# Altium project OpenRIS_0v1.PrjPcb
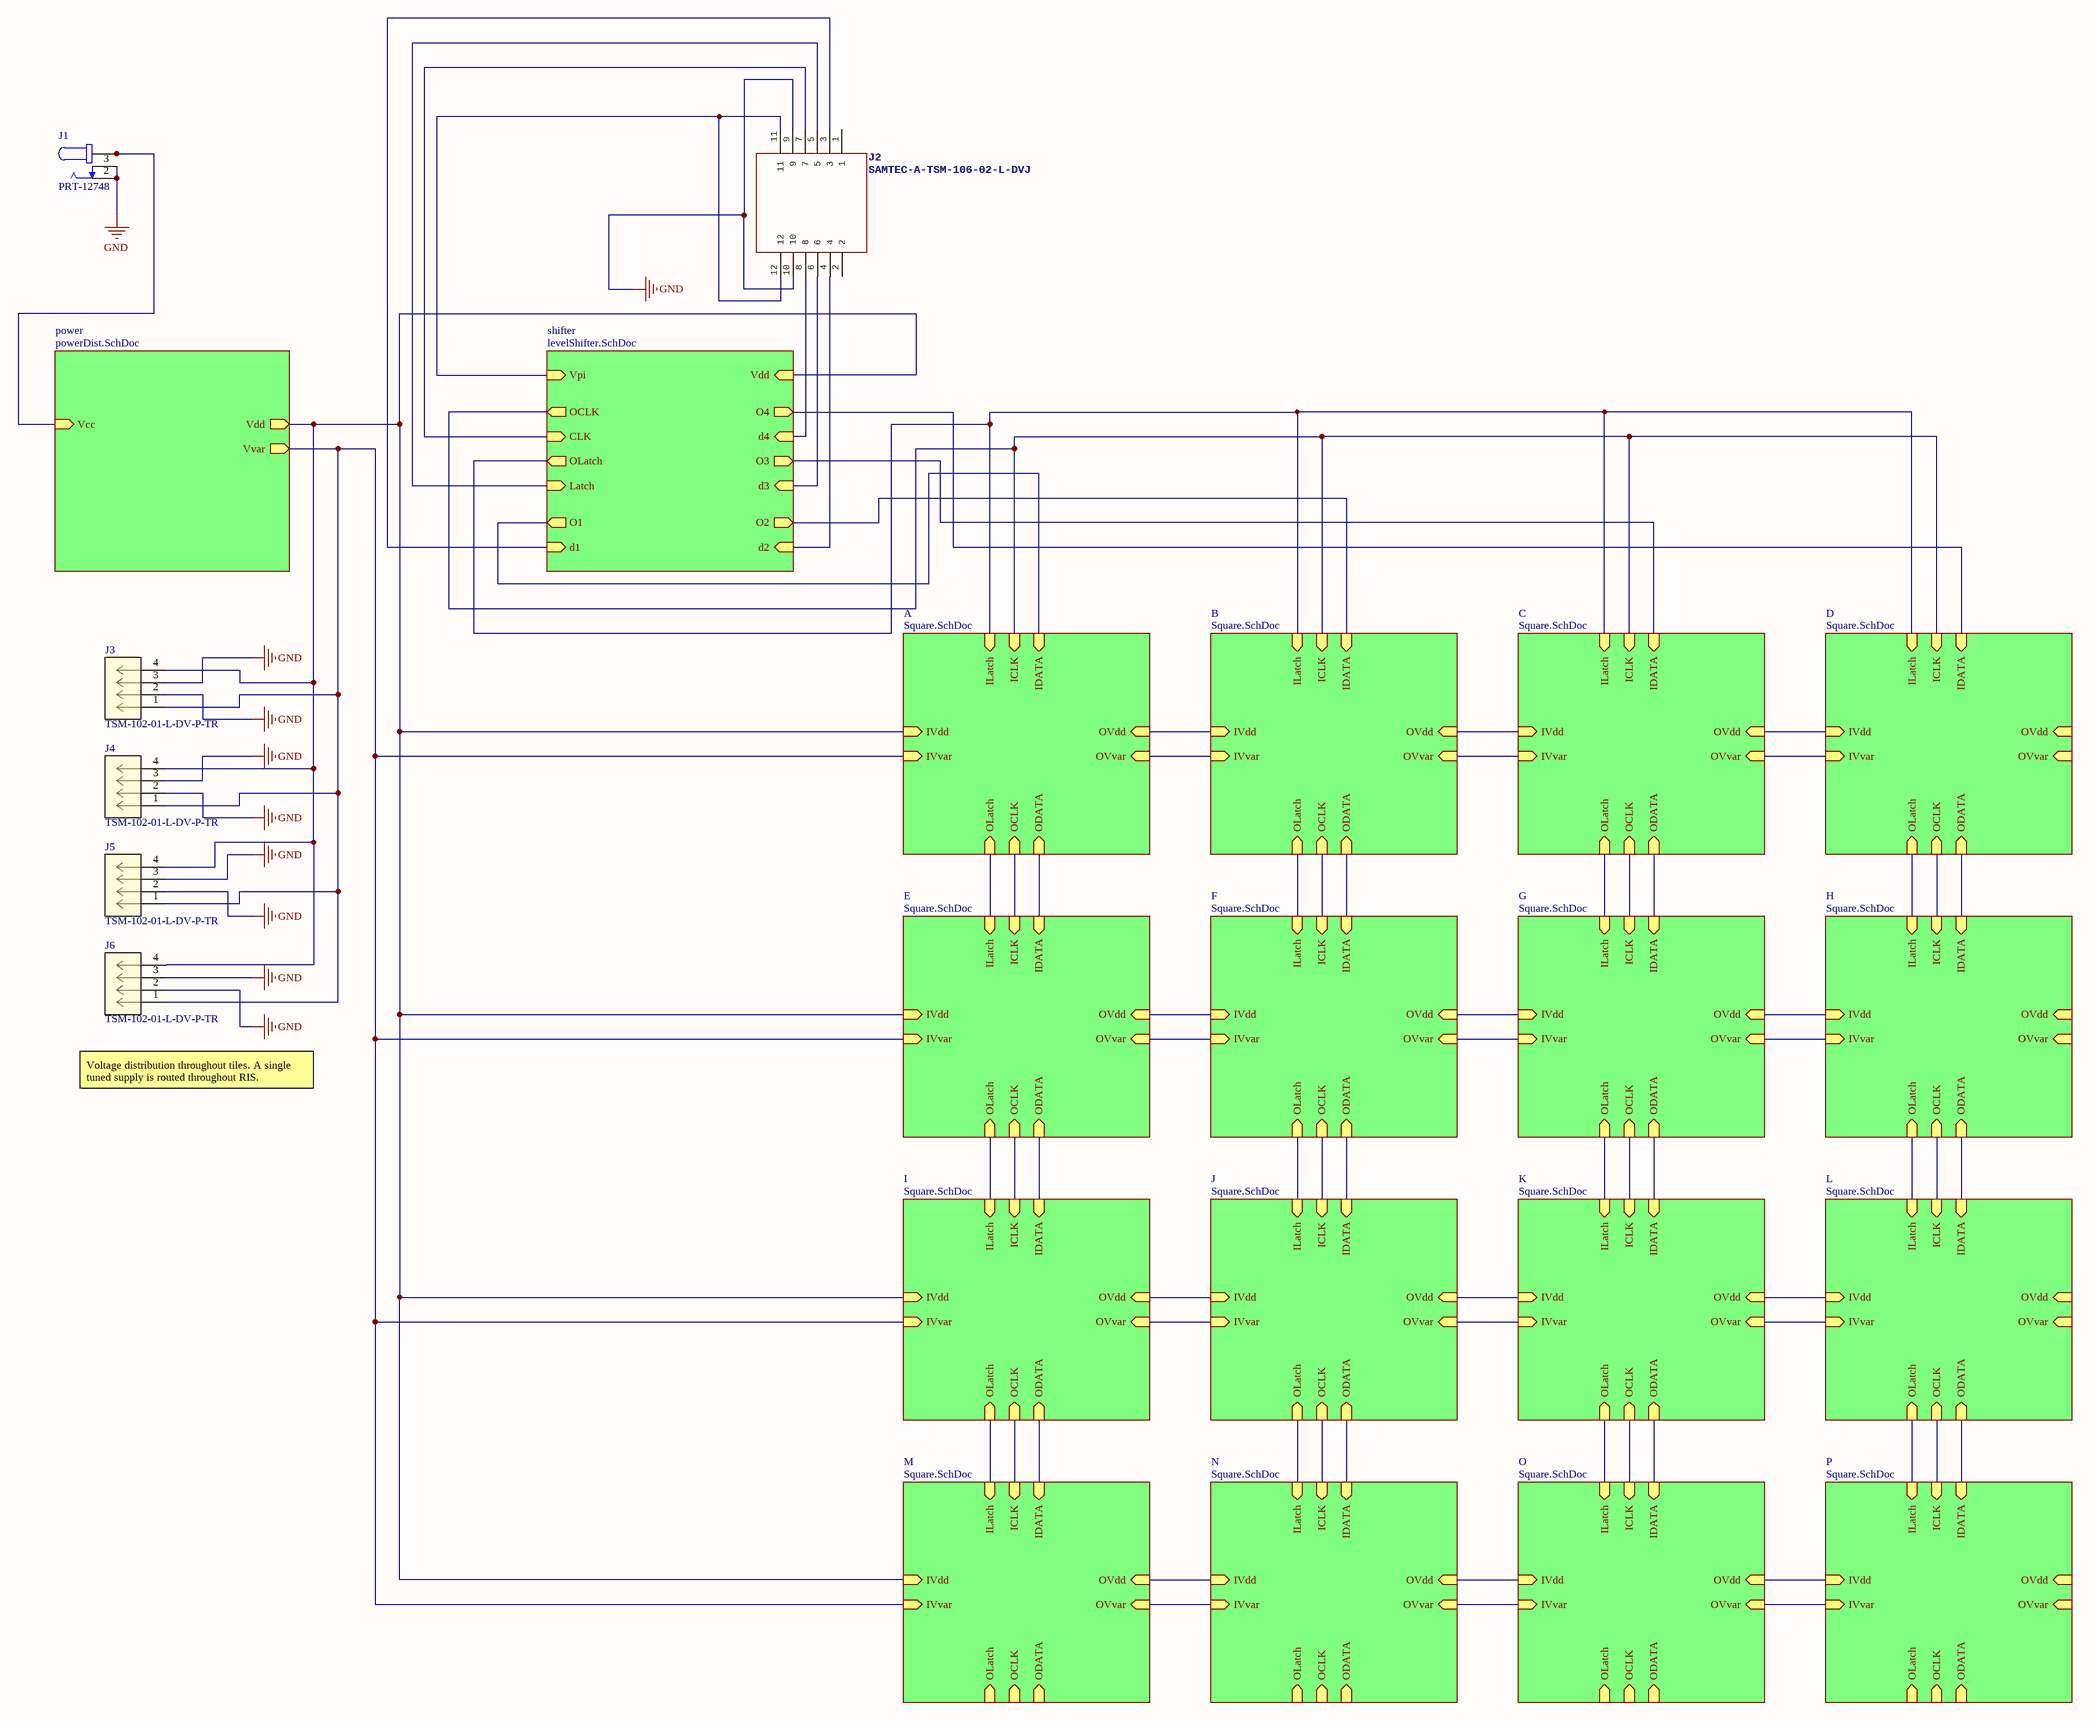
[diagram p0: main.SchDoc]
4 sheets, 547 parts. Net scope: hierarchical (ports join the sheet entries above them; power ports are global).
Board files: OpenRIS_PCB_0v1.PcbDoc, unitcells.PcbDoc, unitCell.PcbDoc
Sheets:
  main.SchDoc
    shifter = levelShifter.SchDoc
    power = powerDist.SchDoc
    A = Square.SchDoc
    E = Square.SchDoc
    I = Square.SchDoc
    M = Square.SchDoc
    B = Square.SchDoc
    F = Square.SchDoc
    J = Square.SchDoc
    N = Square.SchDoc
    C = Square.SchDoc
    G = Square.SchDoc
    K = Square.SchDoc
    O = Square.SchDoc
    D = Square.SchDoc
    H = Square.SchDoc
    L = Square.SchDoc
    P = Square.SchDoc

## Sheet main.SchDoc
size A2; SheetNumber: 1; SheetTotal: 4

### Parts
J1  PRT-12748  [SPARKFUN_PRT-12748]
J2  SAMTEC-A-TSM-106-02-L-DVJ  [SAMTEC-A-TSM-106-02-L-DV]
J3  TSM-102-01-L-DV-P-TR  [SAMTEC-A-TSM-102-02-L-DV]
J4  TSM-102-01-L-DV-P-TR  [SAMTEC-A-TSM-102-02-L-DV]
J5  TSM-102-01-L-DV-P-TR  [SAMTEC-A-TSM-102-02-L-DV]
J6  TSM-102-01-L-DV-P-TR  [SAMTEC-A-TSM-102-02-L-DV]

### Sub-sheets
A = Square.SchDoc: IVvar (in), IVdd (in), IDATA (in), ICLK (in), ILatch (in), OLatch (in), OCLK (in), ODATA (in), OVvar (in), OVdd (in)
B = Square.SchDoc: IVvar (in), IVdd (in), IDATA (in), ICLK (in), ILatch (in), OLatch (in), OCLK (in), ODATA (in), OVvar (in), OVdd (in)
C = Square.SchDoc: IVvar (in), IVdd (in), IDATA (in), ICLK (in), ILatch (in), OLatch (in), OCLK (in), ODATA (in), OVvar (in), OVdd (in)
D = Square.SchDoc: IVvar (in), IVdd (in), IDATA (in), ICLK (in), ILatch (in), OLatch (in), OCLK (in), ODATA (in), OVvar (in), OVdd (in)
E = Square.SchDoc: IVvar (in), IVdd (in), IDATA (in), ICLK (in), ILatch (in), OLatch (in), OCLK (in), ODATA (in), OVvar (in), OVdd (in)
F = Square.SchDoc: IVvar (in), IVdd (in), IDATA (in), ICLK (in), ILatch (in), OLatch (in), OCLK (in), ODATA (in), OVvar (in), OVdd (in)
G = Square.SchDoc: IVvar (in), IVdd (in), IDATA (in), ICLK (in), ILatch (in), OLatch (in), OCLK (in), ODATA (in), OVvar (in), OVdd (in)
H = Square.SchDoc: IVvar (in), IVdd (in), IDATA (in), ICLK (in), ILatch (in), OLatch (in), OCLK (in), ODATA (in), OVvar (in), OVdd (in)
I = Square.SchDoc: IVvar (in), IVdd (in), IDATA (in), ICLK (in), ILatch (in), OLatch (in), OCLK (in), ODATA (in), OVvar (in), OVdd (in)
J = Square.SchDoc: IVvar (in), IVdd (in), IDATA (in), ICLK (in), ILatch (in), OLatch (in), OCLK (in), ODATA (in), OVvar (in), OVdd (in)
K = Square.SchDoc: IVvar (in), IVdd (in), IDATA (in), ICLK (in), ILatch (in), OLatch (in), OCLK (in), ODATA (in), OVvar (in), OVdd (in)
L = Square.SchDoc: IVvar (in), IVdd (in), IDATA (in), ICLK (in), ILatch (in), OLatch (in), OCLK (in), ODATA (in), OVvar (in), OVdd (in)
M = Square.SchDoc: IVvar (in), IVdd (in), IDATA (in), ICLK (in), ILatch (in), OLatch (in), OCLK (in), ODATA (in), OVvar (in), OVdd (in)
N = Square.SchDoc: IVvar (in), IVdd (in), IDATA (in), ICLK (in), ILatch (in), OLatch (in), OCLK (in), ODATA (in), OVvar (in), OVdd (in)
O = Square.SchDoc: IVvar (in), IVdd (in), IDATA (in), ICLK (in), ILatch (in), OLatch (in), OCLK (in), ODATA (in), OVvar (in), OVdd (in)
P = Square.SchDoc: IVvar (in), IVdd (in), IDATA (in), ICLK (in), ILatch (in), OLatch (in), OCLK (in), ODATA (in), OVvar (in), OVdd (in)
power = powerDist.SchDoc: Vvar (out), Vdd (out), Vcc (in)
shifter = levelShifter.SchDoc: Vpi (in), Vdd (in), Latch (in), CLK (in), d2 (in), d3 (in), d4 (in), d1 (in), OCLK (out), OLatch (out), O1 (out), O2 (out), O3 (out), O4 (out)

### Nets
GND: J1.2 J1.3 J2.9 J2.10 J3.2 J3.3 J4.2 J4.3 J5.2 J5.3 J6.2 J6.3
NetC1_1: J3.1 J4.1 J5.1 J6.1 ; sheet power/Vvar, sheet A/IVvar, sheet A/OVvar, sheet E/IVvar, sheet E/OVvar, sheet I/IVvar, sheet I/OVvar, sheet M/IVvar, sheet M/OVvar, sheet B/IVvar, sheet B/OVvar, sheet F/IVvar, sheet F/OVvar, sheet J/IVvar, sheet J/OVvar, sheet N/IVvar, sheet N/OVvar, sheet C/IVvar, sheet C/OVvar, sheet G/IVvar, sheet G/OVvar, sheet K/IVvar, sheet K/OVvar, sheet O/IVvar, sheet O/OVvar, sheet D/IVvar, sheet D/OVvar, sheet H/IVvar, sheet H/OVvar, sheet L/IVvar, sheet L/OVvar, sheet P/IVvar, sheet P/OVvar
NetC2_1: J3.4 J4.4 J5.4 J6.4 ; sheet shifter/Vdd, sheet power/Vdd, sheet A/IVdd, sheet A/OVdd, sheet E/IVdd, sheet E/OVdd, sheet I/IVdd, sheet I/OVdd, sheet M/IVdd, sheet M/OVdd, sheet B/IVdd, sheet B/OVdd, sheet F/IVdd, sheet F/OVdd, sheet J/IVdd, sheet J/OVdd, sheet N/IVdd, sheet N/OVdd, sheet C/IVdd, sheet C/OVdd, sheet G/IVdd, sheet G/OVdd, sheet K/IVdd, sheet K/OVdd, sheet O/IVdd, sheet O/OVdd, sheet D/IVdd, sheet D/OVdd, sheet H/IVdd, sheet H/OVdd, sheet L/IVdd, sheet L/OVdd, sheet P/IVdd, sheet P/OVdd
NetIC1_3: J1.1_1 J1.1_2 ; sheet power/Vcc
NetJ2_3: J2.3 ; sheet shifter/d1
NetJ2_4: J2.4 ; sheet shifter/d2
NetJ2_5: J2.5 ; sheet shifter/Latch
NetJ2_6: J2.6 ; sheet shifter/d3
NetJ2_7: J2.7 ; sheet shifter/CLK
NetJ2_8: J2.8 ; sheet shifter/d4
NetJ2_11: J2.11 J2.12 ; sheet shifter/Vpi
NetU1_2: sheet shifter/OCLK, sheet A/ICLK, sheet A/OCLK, sheet E/ICLK, sheet E/OCLK, sheet I/ICLK, sheet I/OCLK, sheet M/ICLK, sheet M/OCLK, sheet B/ICLK, sheet B/OCLK, sheet F/ICLK, sheet F/OCLK, sheet J/ICLK, sheet J/OCLK, sheet N/ICLK, sheet N/OCLK, sheet C/ICLK, sheet C/OCLK, sheet G/ICLK, sheet G/OCLK, sheet K/ICLK, sheet K/OCLK, sheet O/ICLK, sheet O/OCLK, sheet D/ICLK, sheet D/OCLK, sheet H/ICLK, sheet H/OCLK, sheet L/ICLK, sheet L/OCLK, sheet P/ICLK, sheet P/OCLK
NetU1_4: sheet shifter/OLatch, sheet A/ILatch, sheet A/OLatch, sheet E/ILatch, sheet E/OLatch, sheet I/ILatch, sheet I/OLatch, sheet M/ILatch, sheet M/OLatch, sheet B/ILatch, sheet B/OLatch, sheet F/ILatch, sheet F/OLatch, sheet J/ILatch, sheet J/OLatch, sheet N/ILatch, sheet N/OLatch, sheet C/ILatch, sheet C/OLatch, sheet G/ILatch, sheet G/OLatch, sheet K/ILatch, sheet K/OLatch, sheet O/ILatch, sheet O/OLatch, sheet D/ILatch, sheet D/OLatch, sheet H/ILatch, sheet H/OLatch, sheet L/ILatch, sheet L/OLatch, sheet P/ILatch, sheet P/OLatch
NetU1_6: sheet shifter/O1, sheet A/IDATA
NetU1_10: sheet shifter/O2, sheet B/IDATA
NetU1_12: sheet shifter/O3, sheet C/IDATA
NetU1_15: sheet shifter/O4, sheet D/IDATA
NetU2_A_23: sheet A/ODATA, sheet E/IDATA
NetU2_B_23: sheet B/ODATA, sheet F/IDATA
NetU2_C_23: sheet C/ODATA, sheet G/IDATA
NetU2_D_23: sheet D/ODATA, sheet H/IDATA
NetU2_E_23: sheet E/ODATA, sheet I/IDATA
NetU2_F_23: sheet F/ODATA, sheet J/IDATA
NetU2_G_23: sheet G/ODATA, sheet K/IDATA
NetU2_H_23: sheet H/ODATA, sheet L/IDATA
NetU2_I_23: sheet I/ODATA, sheet M/IDATA
NetU2_J_23: sheet J/ODATA, sheet N/IDATA
NetU2_K_23: sheet K/ODATA, sheet O/IDATA
NetU2_L_23: sheet L/ODATA, sheet P/IDATA

Not connected (* = marked no-connect by the designer): J2 1 2

### Notes on the sheet
- Voltage distribution throughout tiles. A single tuned supply is routed throughout RIS.

### Library data of the parts
J1 = PRT-12748: SparkFun Accessories DC Barrel Power Jack Connector SMD; Package: None; SnapEDA_Link: https://www.snapeda.com/parts/PRT-12748/SparkFun/view-part/?ref=snap; Value: *; MP: PRT-12748; Availability: In Stock; MF: SparkFun; Price: None; Purchase-URL: https://pricing.snapeda.com/search/part/PRT-12748/?ref=eda; Check_prices: https://www.snapeda.com/parts/PRT-12748/SparkFun/view-part/?ref=eda
J3-J6 = TSM-102-01-L-DV-P-TR: No Description Available; Mfr_Name: Samtec Inc; Copyright: Copyright (C) 2022 Ultra Librarian. All rights reserved.; Manufacturer_Part_Number: TSM-102-01-L-DV-P-TR; RefDes: RefDes; Type: DEV

## Sheet levelShifter.SchDoc
size A4; SheetNumber: 4; SheetTotal: 4
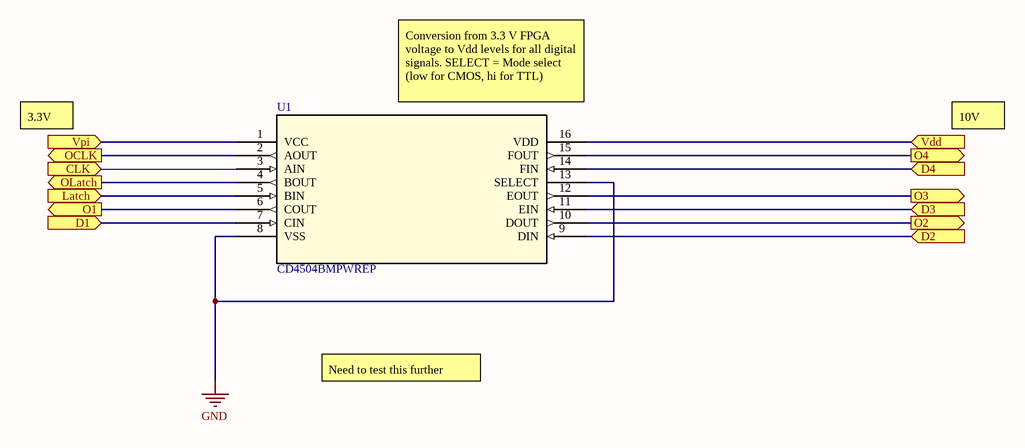
[diagram p1: levelShifter.SchDoc]

### Parts
U1  CD4504BMPWREP  [PW16]

### Ports
CLK (in), D1 (in), D2 (in), D3 (in), D4 (in), Latch (in), O1 (out), O2 (out), O3 (out), O4 (out), OCLK (out), OLatch (out), Vdd (in), Vpi (in)

### Nets
GND: U1.8(VSS) U1.13(SELECT)
NetC2_1: U1.16(VDD) ; port Vdd
NetJ2_3: U1.7(CIN) ; port D1
NetJ2_4: U1.9(DIN) ; port D2
NetJ2_5: U1.5(BIN) ; port Latch
NetJ2_6: U1.11(EIN) ; port D3
NetJ2_7: U1.3(AIN) ; port CLK
NetJ2_8: U1.14(FIN) ; port D4
NetJ2_11: U1.1(VCC) ; port Vpi
NetU1_2: U1.2(AOUT) ; port OCLK
NetU1_4: U1.4(BOUT) ; port OLatch
NetU1_6: U1.6(COUT) ; port O1
NetU1_10: U1.10(DOUT) ; port O2
NetU1_12: U1.12(EOUT) ; port O3
NetU1_15: U1.15(FOUT) ; port O4

### Notes on the sheet
- 3.3V
- (near U1) Conversion from 3.3 V FPGA voltage to Vdd levels for all digital signals. SELECT = Mode select (low for CMOS, hi for TTL)
- 10V
- Need to test this further

### Library data of the parts
U1 = CD4504BMPWREP: No Description Available; Mfr_Name: Texas Instruments; Copyright: Copyright (C) 2022 Ultra Librarian. All rights reserved.; Manufacturer_Part_Number: CD4504BMPWREP; RefDes: RefDes; Type: DEV

## Sheet powerDist.SchDoc
size E; SheetNumber: 3; SheetTotal: 4
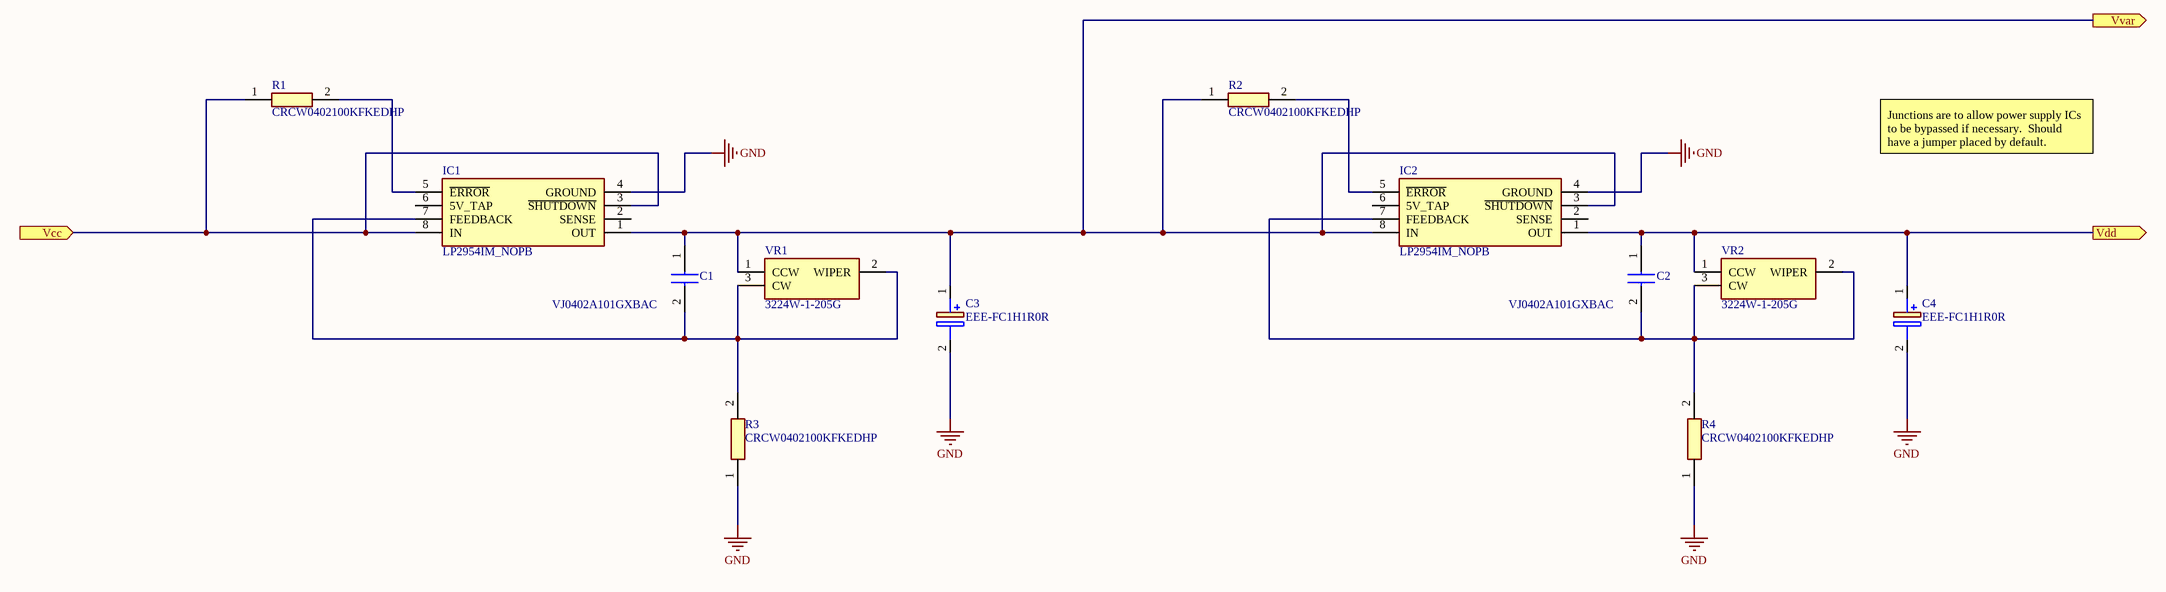
[diagram p2: powerDist.SchDoc]

### Parts
C1  VJ0402A101GXBAC  [CAPC1005X55N]
C2  VJ0402A101GXBAC  [CAPC1005X55N]
C3  EEE-FC1H1R0R  [EEE1AA220WR]
C4  EEE-FC1H1R0R  [EEE1AA220WR]
IC1  LP2954IM_NOPB  [SOIC127P600X175-8N]
IC2  LP2954IM_NOPB  [SOIC127P600X175-8N]
R1  CRCW0402100KFKEDHP  [RESC1005X40N]
R2  CRCW0402100KFKEDHP  [RESC1005X40N]
R3  CRCW0402100KFKEDHP  [RESC1005X40N]
R4  CRCW0402100KFKEDHP  [RESC1005X40N]
VR1  3224W-1-205G  [3224W1205G]
VR2  3224W-1-205G  [3224W1205G]

### Ports
Vcc (in), Vdd (out), Vvar (out)

### Nets
GND: C3.2(-) C4.2(-) IC1.4(GROUND) IC2.4(GROUND) R3.1 R4.1
NetC1_1: C1.1 C3.1(+) IC1.1(OUT) IC2.3(~{SHUTDOWN}) IC2.8(IN) R2.1 VR1.1(CCW) ; port Vvar
NetC1_2: C1.2 IC1.7(FEEDBACK) R3.2 VR1.2(WIPER) VR1.3(CW)
NetC2_1: C2.1 C4.1(+) IC2.1(OUT) VR2.1(CCW) ; port Vdd
NetC2_2: C2.2 IC2.7(FEEDBACK) R4.2 VR2.2(WIPER) VR2.3(CW)
NetIC1_3: IC1.3(~{SHUTDOWN}) IC1.8(IN) R1.1 ; port Vcc
NetIC1_5: IC1.5(~{ERROR}) R1.2
NetIC2_5: IC2.5(~{ERROR}) R2.2

Not connected (* = marked no-connect by the designer): IC1 2(SENSE) 6(5V_TAP); IC2 2(SENSE) 6(5V_TAP)

### Notes on the sheet
- Junctions are to allow power supply ICs to be bypassed if necessary.  Should have a jumper placed by default.

### Library data of the parts
C1 C2 = VJ0402A101GXBAC: Capacitor; Manufacturer_Name: Vishay; Datasheet Link: http://www.vishay.com/docs/45226/vj31xrohsautomlcc.pdf; Height: 0.55mm; Manufacturer_Part_Number: VJ0402A101GXBAC; Mouser Part Number: 77-VJ0402A101GXBAC; Mouser Price/Stock: https://www.mouser.com/Search/Refine.aspx?Keyword=77-VJ0402A101GXBAC
C3 C4 = EEE-FC1H1R0R: Capacitor Polarised; Manufacturer_Name: Panasonic; Datasheet Link: http://industrial.panasonic.com/cdbs/www-data/pdf/RDE0000/ABA0000C1172.pdf; Height: 5.5mm; Manufacturer_Part_Number: EEE-FC1H1R0R
IC1 IC2 = LP2954IM_NOPB: Integrated Circuit; Manufacturer_Name: Texas Instruments; Manufacturer_Part_Number: LP2954IM/NOPB; Datasheet Link: http://www.ti.com/lit/ds/symlink/lp2954.pdf; Height: 1.75mm; Mouser Part Number: 926-LP2954IM/NOPB; Mouser Price/Stock: https://www.mouser.co.uk/ProductDetail/Texas-Instruments/LP2954IM-NOPB?qs=7lkVKPoqpbabRBZ4oJW1Cw%3D%3D; Arrow Part Number: LP2954IM/NOPB; Arrow Price/Stock: https://www.arrow.com/en/products/lp2954imnopb/texas-instruments
R1-R4 = CRCW0402100KFKEDHP: Resistor; Manufacturer_Name: Vishay; Datasheet Link: http://www.vishay.com/docs/20035/dcrcwe3.pdf; Height: 0.4mm; Manufacturer_Part_Number: CRCW0402100KFKEDHP; Mouser Part Number: 71-CRCW0402100KFKEDH; Mouser Price/Stock: https://www.mouser.co.uk/ProductDetail/Vishay-Dale/CRCW0402100KFKEDHP?qs=k2%2FDWSARqgGFakjlJe4Ejw%3D%3D; Arrow Part Number: CRCW0402100KFKEDHP; Arrow Price/Stock: https://www.arrow.com/en/products/crcw0402100kfkedhp/vishay?region=nac
VR1 VR2 = 3224W-1-205G: Variable Resistor; Manufacturer_Name: Bourns; Datasheet Link: https://componentsearchengine.com/Datasheets/1/3224W-1-205G.pdf; Height: 5.3mm; Manufacturer_Part_Number: 3224W-1-205G; Mouser Part Number: 652-3224W-1-205G; Mouser Price/Stock: https://www.mouser.co.uk/ProductDetail/Bourns/3224W-1-205G?qs=ex25RYyDdK9tk4UnpJ5t%2Fg%3D%3D

## Sheet Square.SchDoc
size 863 x 558 mm; SheetNumber: 4; SheetTotal: 4
Used 16 times, as channels A, E, I, M, B, F, J, N, C, G, K, O, D, H, L, P. Parts and nets are listed once, with the designators drawn on the sheet.
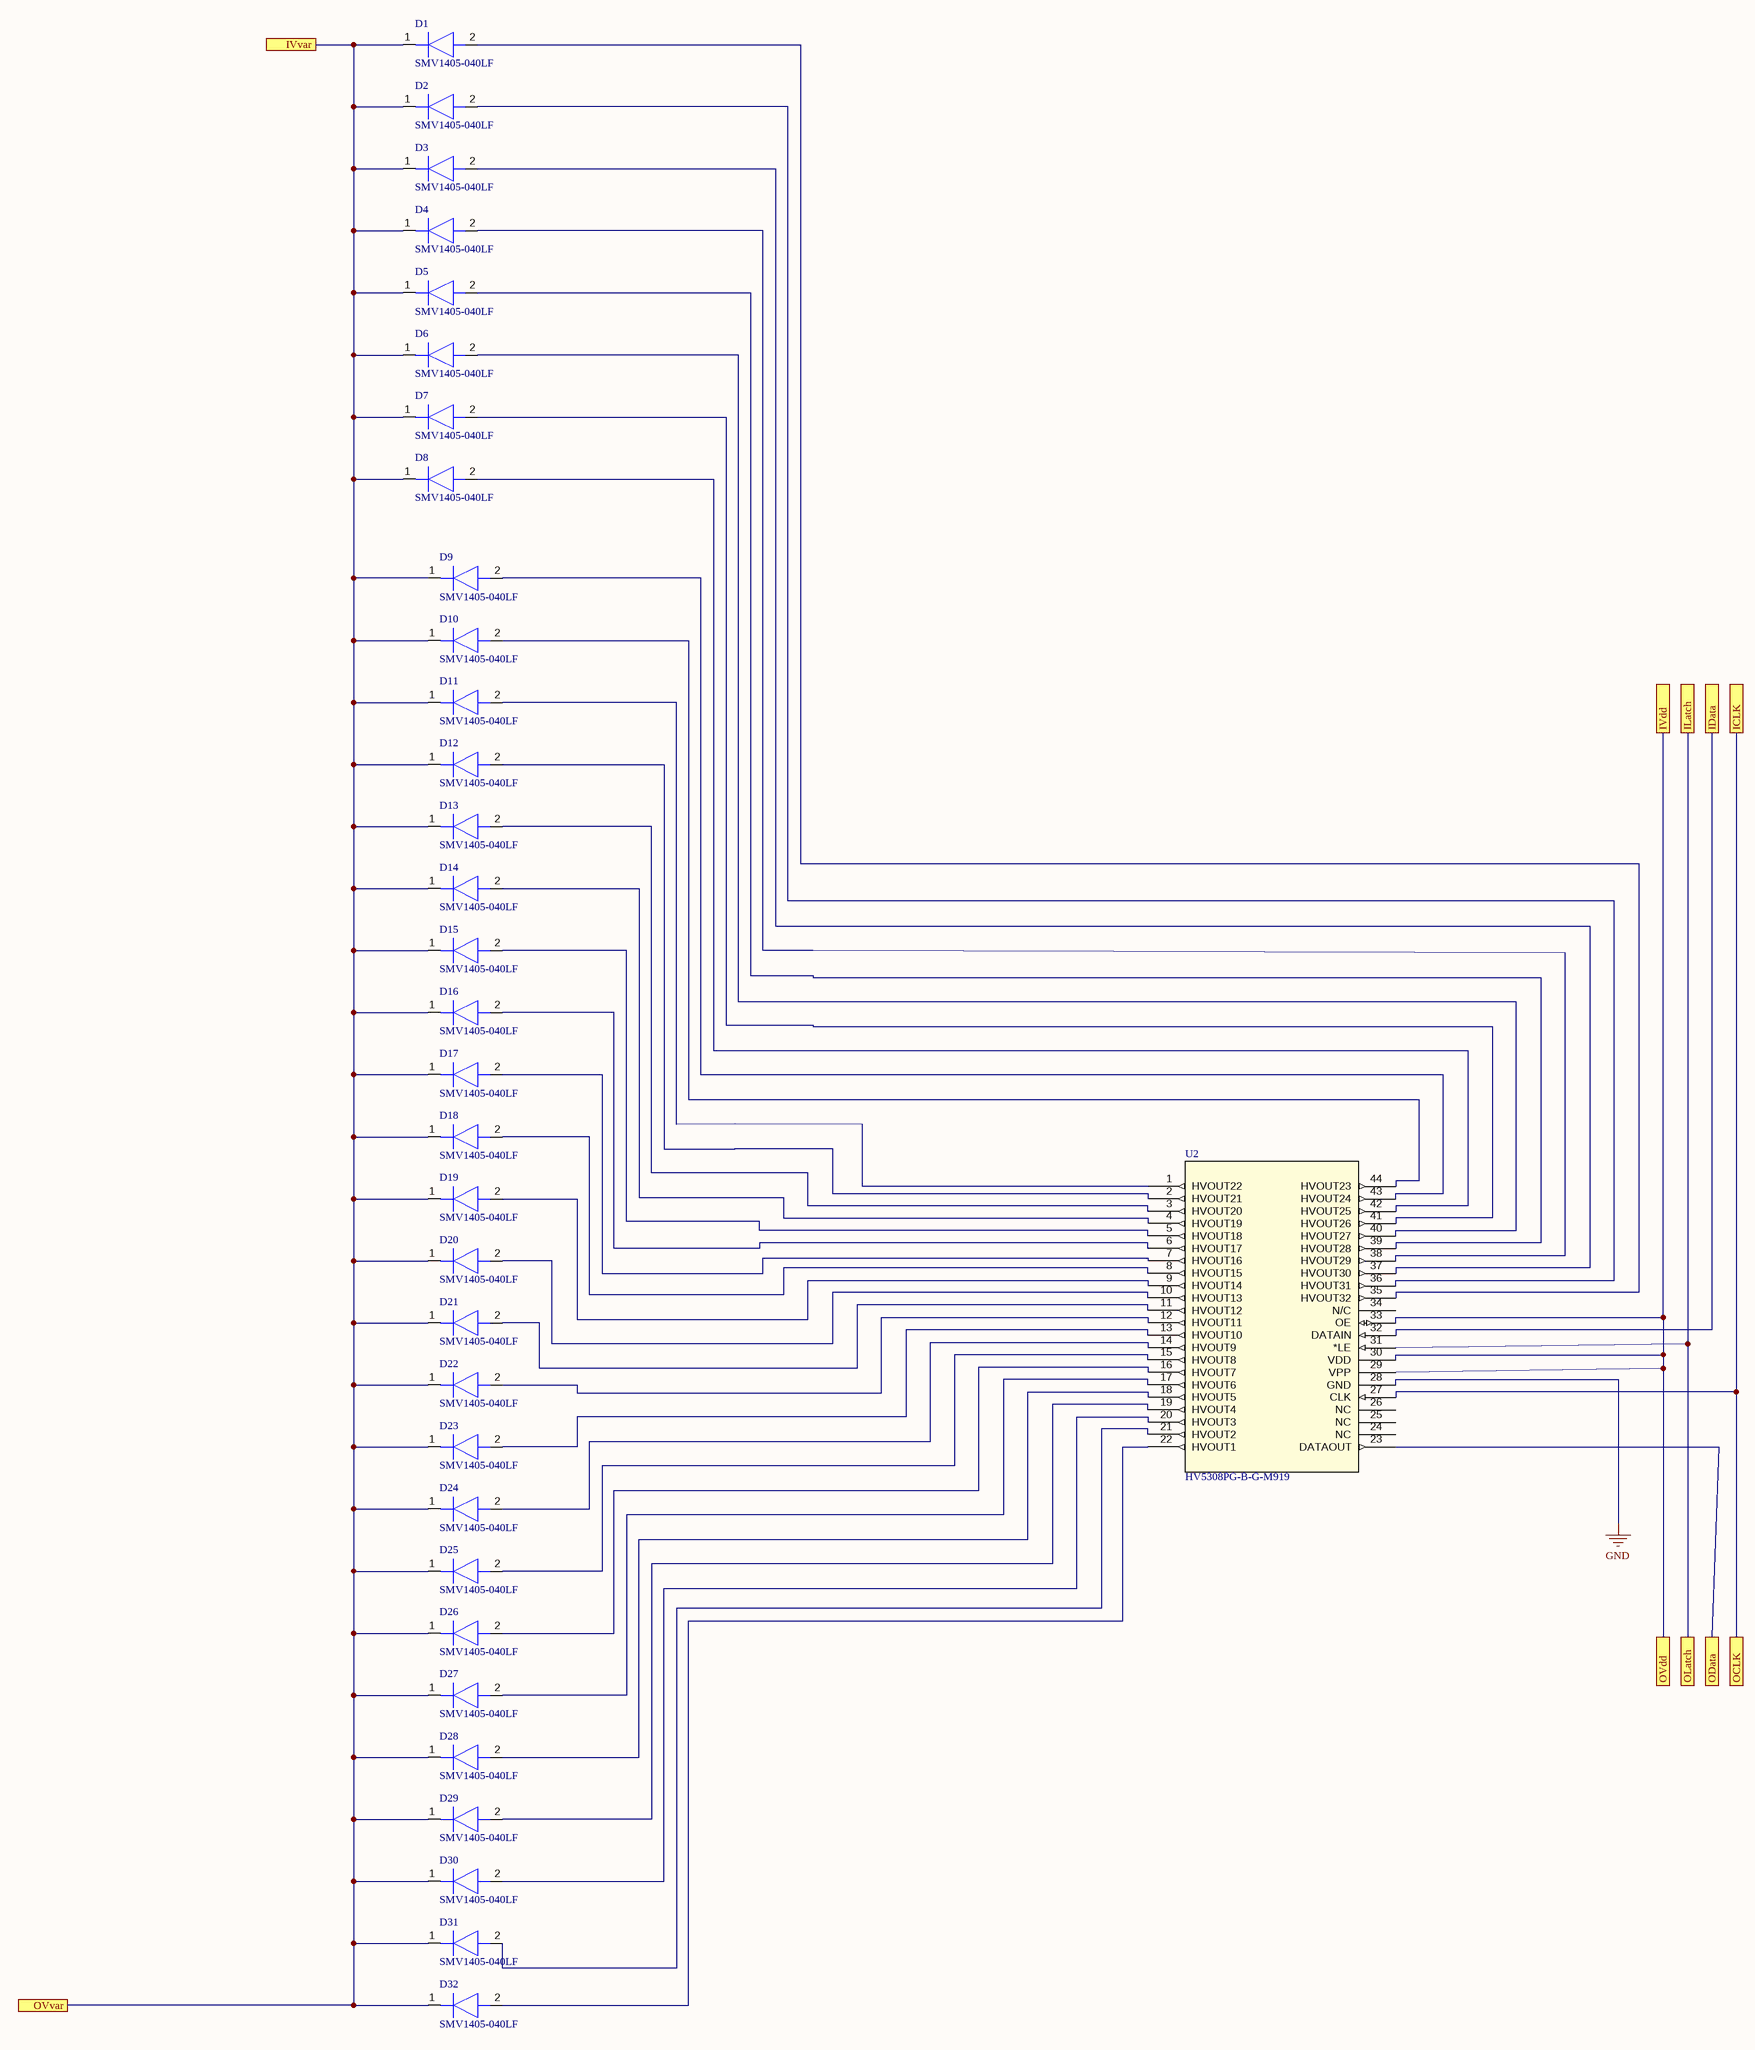
[diagram p3: Square.SchDoc]

### Parts
D1  SMV1405-040LF  [SMV1405040LF]
D2  SMV1405-040LF  [SMV1405040LF]
D3  SMV1405-040LF  [SMV1405040LF]
D4  SMV1405-040LF  [SMV1405040LF]
D5  SMV1405-040LF  [SMV1405040LF]
D6  SMV1405-040LF  [SMV1405040LF]
D7  SMV1405-040LF  [SMV1405040LF]
D8  SMV1405-040LF  [SMV1405040LF]
D9  SMV1405-040LF  [SMV1405040LF]
D10  SMV1405-040LF  [SMV1405040LF]
D11  SMV1405-040LF  [SMV1405040LF]
D12  SMV1405-040LF  [SMV1405040LF]
D13  SMV1405-040LF  [SMV1405040LF]
D14  SMV1405-040LF  [SMV1405040LF]
D15  SMV1405-040LF  [SMV1405040LF]
D16  SMV1405-040LF  [SMV1405040LF]
D17  SMV1405-040LF  [SMV1405040LF]
D18  SMV1405-040LF  [SMV1405040LF]
D19  SMV1405-040LF  [SMV1405040LF]
D20  SMV1405-040LF  [SMV1405040LF]
D21  SMV1405-040LF  [SMV1405040LF]
D22  SMV1405-040LF  [SMV1405040LF]
D23  SMV1405-040LF  [SMV1405040LF]
D24  SMV1405-040LF  [SMV1405040LF]
D25  SMV1405-040LF  [SMV1405040LF]
D26  SMV1405-040LF  [SMV1405040LF]
D27  SMV1405-040LF  [SMV1405040LF]
D28  SMV1405-040LF  [SMV1405040LF]
D29  SMV1405-040LF  [SMV1405040LF]
D30  SMV1405-040LF  [SMV1405040LF]
D31  SMV1405-040LF  [SMV1405040LF]
D32  SMV1405-040LF  [SMV1405040LF]
U2  HV5308PG-B-G-M919  [QFP44_10x10MC_MCH]

### Ports
ICLK, IData, ILatch, IVdd, IVvar, OCLK, OData, OLatch, OVdd, OVvar

### Nets
GND: U2.28(GND)
ICLK: U2.27(CLK) ; port ICLK, port OCLK
IData: U2.32(DATAIN) ; port IData
ILatch: U2.31(*LE) ; port ILatch, port OLatch
IVdd: U2.29(VPP) U2.30(VDD) U2.33(OE) ; port IVdd, port OVdd
IVvar: D1.1(K) D2.1(K) D3.1(K) D4.1(K) D5.1(K) D6.1(K) D7.1(K) D8.1(K) D9.1(K) D10.1(K) D11.1(K) D12.1(K) D13.1(K) D14.1(K) D15.1(K) D16.1(K) D17.1(K) D18.1(K) D19.1(K) D20.1(K) D21.1(K) D22.1(K) D23.1(K) D24.1(K) D25.1(K) D26.1(K) D27.1(K) D28.1(K) D29.1(K) D30.1(K) D31.1(K) D32.1(K) ; port IVvar, port OVvar
OData: U2.23(DATAOUT) ; port OData
NetD1_2: D1.2(A) U2.35(HVOUT32)
NetD2_2: D2.2(A) U2.36(HVOUT31)
NetD3_2: D3.2(A) U2.37(HVOUT30)
NetD4_2: D4.2(A) U2.38(HVOUT29)
NetD5_2: D5.2(A) U2.39(HVOUT28)
NetD6_2: D6.2(A) U2.40(HVOUT27)
NetD7_2: D7.2(A) U2.41(HVOUT26)
NetD8_2: D8.2(A) U2.42(HVOUT25)
NetD9_2: D9.2(A) U2.43(HVOUT24)
NetD10_2: D10.2(A) U2.44(HVOUT23)
NetD11_2: D11.2(A) U2.1(HVOUT22)
NetD12_2: D12.2(A) U2.2(HVOUT21)
NetD13_2: D13.2(A) U2.3(HVOUT20)
NetD14_2: D14.2(A) U2.4(HVOUT19)
NetD15_2: D15.2(A) U2.5(HVOUT18)
NetD16_2: D16.2(A) U2.6(HVOUT17)
NetD17_2: D17.2(A) U2.7(HVOUT16)
NetD18_2: D18.2(A) U2.8(HVOUT15)
NetD19_2: D19.2(A) U2.9(HVOUT14)
NetD20_2: D20.2(A) U2.10(HVOUT13)
NetD21_2: D21.2(A) U2.11(HVOUT12)
NetD22_2: D22.2(A) U2.12(HVOUT11)
NetD23_2: D23.2(A) U2.13(HVOUT10)
NetD24_2: D24.2(A) U2.14(HVOUT9)
NetD25_2: D25.2(A) U2.15(HVOUT8)
NetD26_2: D26.2(A) U2.16(HVOUT7)
NetD27_2: D27.2(A) U2.17(HVOUT6)
NetD28_2: D28.2(A) U2.18(HVOUT5)
NetD29_2: D29.2(A) U2.19(HVOUT4)
NetD30_2: D30.2(A) U2.20(HVOUT3)
NetD31_2: D31.2(A) U2.21(HVOUT2)
NetD32_2: D32.2(A) U2.22(HVOUT1)

Not connected (* = marked no-connect by the designer): U2 24(NC) 25(NC) 26(NC) 34(N/C)

### Channels
A: designators end in _A; ports ICLK=NetU1_2 IData=NetU1_6 ILatch=NetU1_4 IVdd=NetC2_1 IVvar=NetC1_1 OCLK=NetU1_2 OData=NetU2_A_23 OLatch=NetU1_4 OVdd=NetC2_1 OVvar=NetC1_1
E: designators end in _E; ports ICLK=NetU1_2 IData=NetU2_A_23 ILatch=NetU1_4 IVdd=NetC2_1 IVvar=NetC1_1 OCLK=NetU1_2 OData=NetU2_E_23 OLatch=NetU1_4 OVdd=NetC2_1 OVvar=NetC1_1
I: designators end in _I; ports ICLK=NetU1_2 IData=NetU2_E_23 ILatch=NetU1_4 IVdd=NetC2_1 IVvar=NetC1_1 OCLK=NetU1_2 OData=NetU2_I_23 OLatch=NetU1_4 OVdd=NetC2_1 OVvar=NetC1_1
M: designators end in _M; ports ICLK=NetU1_2 IData=NetU2_I_23 ILatch=NetU1_4 IVdd=NetC2_1 IVvar=NetC1_1 OCLK=NetU1_2 OData=NetU2_M_23 OLatch=NetU1_4 OVdd=NetC2_1 OVvar=NetC1_1
B: designators end in _B; ports ICLK=NetU1_2 IData=NetU1_10 ILatch=NetU1_4 IVdd=NetC2_1 IVvar=NetC1_1 OCLK=NetU1_2 OData=NetU2_B_23 OLatch=NetU1_4 OVdd=NetC2_1 OVvar=NetC1_1
F: designators end in _F; ports ICLK=NetU1_2 IData=NetU2_B_23 ILatch=NetU1_4 IVdd=NetC2_1 IVvar=NetC1_1 OCLK=NetU1_2 OData=NetU2_F_23 OLatch=NetU1_4 OVdd=NetC2_1 OVvar=NetC1_1
J: designators end in _J; ports ICLK=NetU1_2 IData=NetU2_F_23 ILatch=NetU1_4 IVdd=NetC2_1 IVvar=NetC1_1 OCLK=NetU1_2 OData=NetU2_J_23 OLatch=NetU1_4 OVdd=NetC2_1 OVvar=NetC1_1
N: designators end in _N; ports ICLK=NetU1_2 IData=NetU2_J_23 ILatch=NetU1_4 IVdd=NetC2_1 IVvar=NetC1_1 OCLK=NetU1_2 OData=NetU2_N_23 OLatch=NetU1_4 OVdd=NetC2_1 OVvar=NetC1_1
C: designators end in _C; ports ICLK=NetU1_2 IData=NetU1_12 ILatch=NetU1_4 IVdd=NetC2_1 IVvar=NetC1_1 OCLK=NetU1_2 OData=NetU2_C_23 OLatch=NetU1_4 OVdd=NetC2_1 OVvar=NetC1_1
G: designators end in _G; ports ICLK=NetU1_2 IData=NetU2_C_23 ILatch=NetU1_4 IVdd=NetC2_1 IVvar=NetC1_1 OCLK=NetU1_2 OData=NetU2_G_23 OLatch=NetU1_4 OVdd=NetC2_1 OVvar=NetC1_1
K: designators end in _K; ports ICLK=NetU1_2 IData=NetU2_G_23 ILatch=NetU1_4 IVdd=NetC2_1 IVvar=NetC1_1 OCLK=NetU1_2 OData=NetU2_K_23 OLatch=NetU1_4 OVdd=NetC2_1 OVvar=NetC1_1
O: designators end in _O; ports ICLK=NetU1_2 IData=NetU2_K_23 ILatch=NetU1_4 IVdd=NetC2_1 IVvar=NetC1_1 OCLK=NetU1_2 OData=NetU2_O_23 OLatch=NetU1_4 OVdd=NetC2_1 OVvar=NetC1_1
D: designators end in _D; ports ICLK=NetU1_2 IData=NetU1_15 ILatch=NetU1_4 IVdd=NetC2_1 IVvar=NetC1_1 OCLK=NetU1_2 OData=NetU2_D_23 OLatch=NetU1_4 OVdd=NetC2_1 OVvar=NetC1_1
H: designators end in _H; ports ICLK=NetU1_2 IData=NetU2_D_23 ILatch=NetU1_4 IVdd=NetC2_1 IVvar=NetC1_1 OCLK=NetU1_2 OData=NetU2_H_23 OLatch=NetU1_4 OVdd=NetC2_1 OVvar=NetC1_1
L: designators end in _L; ports ICLK=NetU1_2 IData=NetU2_H_23 ILatch=NetU1_4 IVdd=NetC2_1 IVvar=NetC1_1 OCLK=NetU1_2 OData=NetU2_L_23 OLatch=NetU1_4 OVdd=NetC2_1 OVvar=NetC1_1
P: designators end in _P; ports ICLK=NetU1_2 IData=NetU2_L_23 ILatch=NetU1_4 IVdd=NetC2_1 IVvar=NetC1_1 OCLK=NetU1_2 OData=NetU2_P_23 OLatch=NetU1_4 OVdd=NetC2_1 OVvar=NetC1_1

### Notes on the sheet
- DWG. NO.
- REV.
- SHT.
- REVISION
- DESCRIPTION
- DATE
- APPROVED
- THIS DOCUMENT AND THE DATA DISCLOSED HEREIN OR HEREWITH IS THE PROPERTY OF ALTIUM LIMITED AND MAY BE FREELY DISTRIBUTED IN WHOLE. NO RIGHTS ARE RESERVED OR EXPRESS OR IMPLIED WARANTEE GIVEN.
- ENG:
- DSN:
- APPROVALS
- PROJECT
- DOCUMENT REVISION:
- DESIGN ITEM:
- CHK:
- BOM:
- REFERENCE DOCUMENTS
- PROJECT REVISION:
- TITLE
- FAB DWG:
- PCB DWG:
- ASSY DWG:
- SCALE:
- SIZE
- D
- CAGE CODE
- FILE NAME
- DWG NO.
- SHEET
- OF
- REV

### Library data of the parts
D1-D32 = SMV1405-040LF: Diode; Manufacturer_Name: Skyworks; Datasheet Link: https://componentsearchengine.com/Datasheets/1/SMV1405-040LF.pdf; Height: 0.5mm; Manufacturer_Part_Number: SMV1405-040LF; Mouser Part Number: 873-SMV1405-040LF; Mouser Price/Stock: https://www.mouser.co.uk/ProductDetail/Skyworks-Solutions-Inc/SMV1405-040LF?qs=WMHGlxXAKT83CwR50Zj5aw%3D%3D
U2 = HV5308PG-B-G-M919: No Description Available; Mfr_Name: Microchip; Copyright: Copyright (C) 2022 Ultra Librarian. All rights reserved.; Manufacturer_Part_Number: HV5308PG-B-G-M919; RefDes: RefDes; Type: DEV

## Nets that join several sheets
GND: main (12 pins), levelShifter (U1.8 U1.13), powerDist (6 pins), A (U2_A.28), E (U2_E.28), I (U2_I.28), M (U2_M.28), B (U2_B.28), F (U2_F.28), J (U2_J.28), N (U2_N.28), C (U2_C.28), G (U2_G.28), K (U2_K.28), O (U2_O.28), D (U2_D.28), H (U2_H.28), L (U2_L.28), P (U2_P.28)
NetC1_1: main (J3.1 J4.1 J5.1 J6.1), powerDist (7 pins), A (32 pins), E (32 pins), I (32 pins), M (32 pins), B (32 pins), F (32 pins), J (32 pins), N (32 pins), C (32 pins), G (32 pins), K (32 pins), O (32 pins), D (32 pins), H (32 pins), L (32 pins), P (32 pins)
NetC2_1: main (J3.4 J4.4 J5.4 J6.4), levelShifter (U1.16), powerDist (C2.1 C4.1 IC2.1 VR2.1), A (U2_A.29 U2_A.30 U2_A.33), E (U2_E.29 U2_E.30 U2_E.33), I (U2_I.29 U2_I.30 U2_I.33), M (U2_M.29 U2_M.30 U2_M.33), B (U2_B.29 U2_B.30 U2_B.33), F (U2_F.29 U2_F.30 U2_F.33), J (U2_J.29 U2_J.30 U2_J.33), N (U2_N.29 U2_N.30 U2_N.33), C (U2_C.29 U2_C.30 U2_C.33), G (U2_G.29 U2_G.30 U2_G.33), K (U2_K.29 U2_K.30 U2_K.33), O (U2_O.29 U2_O.30 U2_O.33), D (U2_D.29 U2_D.30 U2_D.33), H (U2_H.29 U2_H.30 U2_H.33), L (U2_L.29 U2_L.30 U2_L.33), P (U2_P.29 U2_P.30 U2_P.33)
NetIC1_3: main (J1.1_1 J1.1_2), powerDist (IC1.3 IC1.8 R1.1)
NetJ2_3: main (J2.3), levelShifter (U1.7)
NetJ2_4: main (J2.4), levelShifter (U1.9)
NetJ2_5: main (J2.5), levelShifter (U1.5)
NetJ2_6: main (J2.6), levelShifter (U1.11)
NetJ2_7: main (J2.7), levelShifter (U1.3)
NetJ2_8: main (J2.8), levelShifter (U1.14)
NetJ2_11: main (J2.11 J2.12), levelShifter (U1.1)
NetU1_2: levelShifter (U1.2), A (U2_A.27), E (U2_E.27), I (U2_I.27), M (U2_M.27), B (U2_B.27), F (U2_F.27), J (U2_J.27), N (U2_N.27), C (U2_C.27), G (U2_G.27), K (U2_K.27), O (U2_O.27), D (U2_D.27), H (U2_H.27), L (U2_L.27), P (U2_P.27)
NetU1_4: levelShifter (U1.4), A (U2_A.31), E (U2_E.31), I (U2_I.31), M (U2_M.31), B (U2_B.31), F (U2_F.31), J (U2_J.31), N (U2_N.31), C (U2_C.31), G (U2_G.31), K (U2_K.31), O (U2_O.31), D (U2_D.31), H (U2_H.31), L (U2_L.31), P (U2_P.31)
NetU1_6: levelShifter (U1.6), A (U2_A.32)
NetU1_10: levelShifter (U1.10), B (U2_B.32)
NetU1_12: levelShifter (U1.12), C (U2_C.32)
NetU1_15: levelShifter (U1.15), D (U2_D.32)
NetU2_A_23: A (U2_A.23), E (U2_E.32)
NetU2_B_23: B (U2_B.23), F (U2_F.32)
NetU2_C_23: C (U2_C.23), G (U2_G.32)
NetU2_D_23: D (U2_D.23), H (U2_H.32)
NetU2_E_23: E (U2_E.23), I (U2_I.32)
NetU2_F_23: F (U2_F.23), J (U2_J.32)
NetU2_G_23: G (U2_G.23), K (U2_K.32)
NetU2_H_23: H (U2_H.23), L (U2_L.32)
NetU2_I_23: I (U2_I.23), M (U2_M.32)
NetU2_J_23: J (U2_J.23), N (U2_N.32)
NetU2_K_23: K (U2_K.23), O (U2_O.32)
NetU2_L_23: L (U2_L.23), P (U2_P.32)